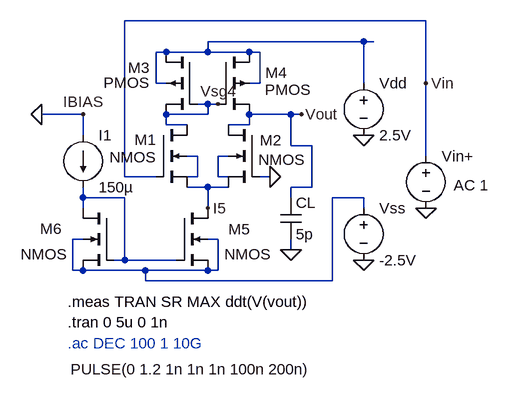
[diagram p0: schematic Ota kazanç-frekans.asc]
Ota kazanç-frekans.asc, the LTspice schematic file:
Version 4.1
SHEET 1 1620 2264
WIRE 560 -32 96 -32
WIRE 464 0 224 0
WIRE 480 0 464 0
WIRE 160 16 144 16
WIRE 224 16 224 0
WIRE 224 16 160 16
WIRE 288 16 224 16
WIRE 304 16 288 16
WIRE 144 64 144 16
WIRE 160 64 144 64
WIRE 304 64 304 16
WIRE 304 64 288 64
WIRE 464 64 464 0
WIRE 560 64 560 -32
WIRE 224 96 208 96
WIRE 240 96 224 96
WIRE 32 112 -32 112
WIRE 224 112 224 96
WIRE 224 112 160 112
WIRE 352 112 288 112
WIRE 368 112 352 112
WIRE 160 128 160 112
WIRE 192 128 160 128
WIRE 288 128 288 112
WIRE 288 128 256 128
WIRE 32 144 32 112
WIRE 352 160 352 112
WIRE 384 160 352 160
WIRE 208 176 192 176
WIRE 256 176 240 176
WIRE 560 176 560 64
WIRE 96 208 96 -32
WIRE 144 208 96 208
WIRE 208 208 208 176
WIRE 208 208 192 208
WIRE 240 208 240 176
WIRE 256 208 240 208
WIRE 320 208 304 208
WIRE 224 224 192 224
WIRE 256 224 224 224
WIRE 384 224 384 160
WIRE 384 224 352 224
WIRE 32 240 32 224
WIRE 96 240 32 240
WIRE 352 240 352 224
WIRE 464 240 416 240
WIRE 32 256 32 240
WIRE 224 256 224 224
WIRE 464 256 464 240
WIRE 32 304 16 304
WIRE 240 304 224 304
WIRE 352 320 352 304
WIRE 96 336 96 240
WIRE 96 336 80 336
WIRE 176 336 96 336
WIRE 16 352 16 304
WIRE 32 352 16 352
WIRE 128 352 32 352
WIRE 224 352 128 352
WIRE 240 352 240 304
WIRE 240 352 224 352
WIRE 128 368 128 352
WIRE 416 368 416 240
WIRE 416 368 128 368
FLAG 352 320 0
FLAG 320 208 0
FLAG 368 112 Vout
FLAG 224 256 I5
FLAG 32 112 IBIAS
FLAG 240 96 Vsg4
FLAG 560 256 0
FLAG 560 64 Vin
FLAG -32 112 0
FLAG 464 144 0
FLAG 464 336 0
SYMBOL nmos4 304 128 M0
WINDOW 0 -34 24 Left 2
WINDOW 3 -70 54 Left 2
SYMATTR InstName M2
SYMBOL nmos4 144 128 R0
WINDOW 0 -33 23 Left 2
WINDOW 3 -71 50 Left 2
SYMATTR InstName M1
SYMBOL nmos4 176 256 R0
WINDOW 0 80 33 Left 2
WINDOW 3 74 71 Left 2
SYMATTR InstName M5
SYMBOL pmos4 240 16 R0
WINDOW 0 73 32 Left 2
WINDOW 3 72 58 Left 2
SYMATTR InstName M4
SYMBOL pmos4 208 16 M0
WINDOW 0 73 24 Left 2
WINDOW 3 74 47 Left 2
SYMATTR InstName M3
SYMBOL nmos4 80 256 M0
WINDOW 0 80 32 Left 2
WINDOW 3 72 71 Left 2
SYMATTR InstName M6
SYMBOL cap 336 240 R0
SYMATTR InstName CL
SYMATTR Value 5p
SYMBOL current 32 144 R0
SYMATTR InstName I1
SYMATTR Value 150µ
SYMBOL voltage 560 160 R0
WINDOW 123 43 61 Left 2
WINDOW 39 0 0 Left 0
WINDOW 3 -547 344 Left 2
SYMATTR Value2 AC 1
SYMATTR InstName Vin+
SYMATTR Value PULSE(0 1.2 1n 1n 1n 100n 200n)
SYMBOL voltage 464 48 R0
SYMATTR InstName Vdd
SYMATTR Value 2.5V
SYMBOL voltage 464 240 R0
SYMATTR InstName Vss
SYMATTR Value -2.5V
TEXT 8 464 Left 2 ;.ac DEC 100 1 10G
TEXT 8 432 Left 2 !.tran 0 5u 0 1n
TEXT 8 400 Left 2 !.meas TRAN SR MAX ddt(V(vout))

The netlist it stands for:
* Ota kazanç-frekans.asc
M2 Vout 0 I5 N003 NMOS
M1 Vsg4 Vin I5 N002 NMOS
M5 I5 N004 N005 N005 NMOS
M4 N001 Vsg4 Vout N001 PMOS
M3 N001 Vsg4 Vsg4 N001 PMOS
M6 N004 N004 N005 N005 NMOS
CL Vout 0 5p
I1 0 N004 150µ
Vin+ Vin 0 PULSE(0 1.2 1n 1n 1n 100n 200n) AC 1
Vdd N001 0 2.5V
Vss N005 0 -2.5V
.model NMOS NMOS
.model PMOS PMOS
.lib standard.mos
* .ac DEC 100 1 10G
.tran 0 5u 0 1n
.meas TRAN SR MAX ddt(V(vout))
.backanno
.end